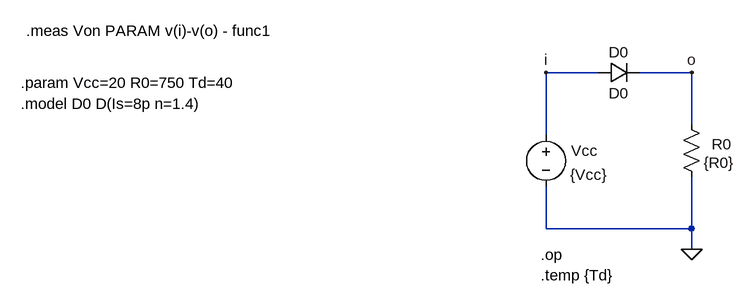
[diagram p0: schematic DIODEMODEL01op.asc]
DIODEMODEL01op.asc, the LTspice schematic file:
Version 4
SHEET 1 1608 1076
WIRE 944 -176 864 -176
WIRE 1088 -176 1008 -176
WIRE 1088 -96 1088 -176
WIRE 864 -80 864 -176
WIRE 864 64 864 0
WIRE 1088 64 1088 -16
WIRE 1088 64 864 64
WIRE 1088 96 1088 64
FLAG 1088 96 0
FLAG 864 -176 i
FLAG 1088 -176 o
SYMBOL voltage 864 -96 R0
WINDOW 123 0 0 Left 0
WINDOW 39 0 0 Left 0
WINDOW 0 39 40 Left 2
WINDOW 3 37 77 Left 2
SYMATTR InstName Vcc
SYMATTR Value {Vcc}
SYMBOL res 1072 -112 R0
WINDOW 0 47 46 Left 2
WINDOW 3 35 75 Left 2
SYMATTR InstName R0
SYMATTR Value {R0}
SYMBOL diode 944 -160 R270
WINDOW 0 32 32 VTop 2
WINDOW 3 0 32 VBottom 2
SYMATTR InstName D0
SYMATTR Value D0
TEXT 856 104 Left 2 !.op
TEXT 856 136 Left 2 !.temp {Td}
TEXT 64 -240 Left 2 !.meas Von PARAM v(i)-v(o) - func1
TEXT 56 -160 Left 2 !.param Vcc=20 R0=750 Td=40
TEXT 56 -128 Left 2 !.model D0 D(Is=8p n=1.4)

The netlist it stands for:
* DIODEMODEL01op.asc
Vcc i 0 {Vcc}
R0 o 0 {R0}
D0 i o D0
.model D D
.lib standard.dio
.op
.temp {Td}
.meas Von PARAM v(i)-v(o) - func1
.param Vcc=20 R0=750 Td=40
.model D0 D(Is=8p n=1.4)
.backanno
.end